# Altium schematic sheet TPS60400.SchDoc
size A4
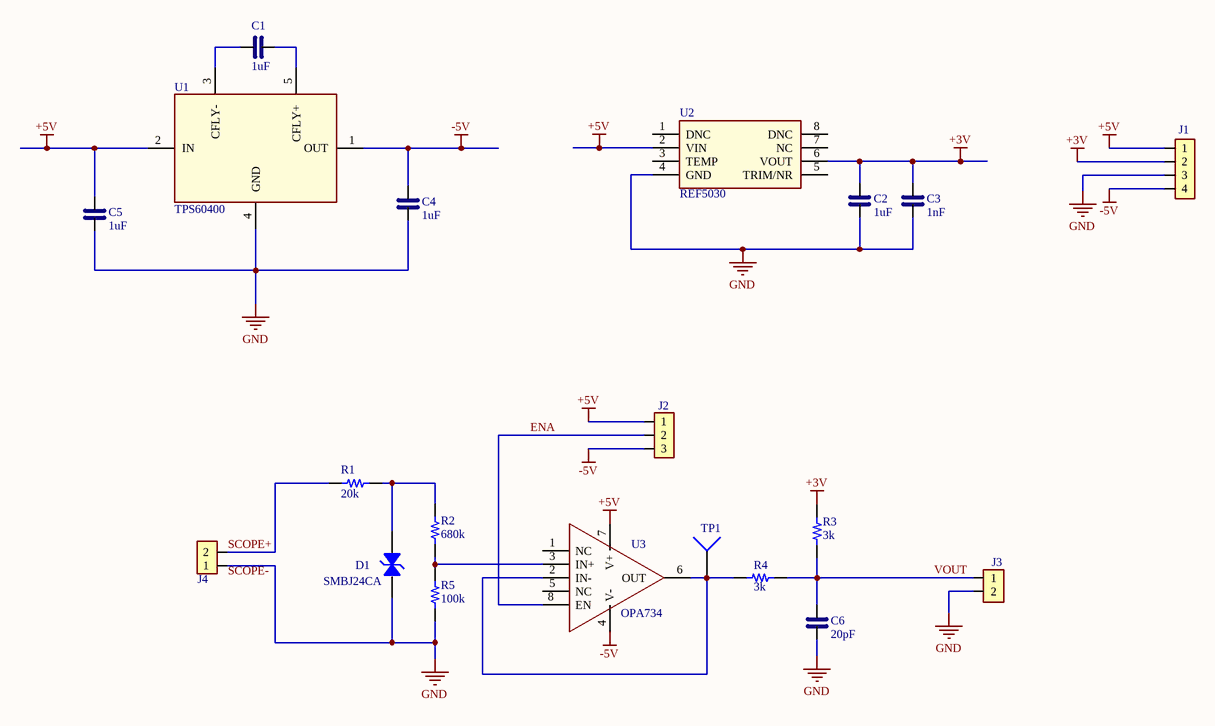
[diagram p0: TPS60400.SchDoc]

## Parts
C1  1uF  [CAP 0805/2012]
C2  1uF  [CAP 0805/2012]
C3  1nF  [CAP 0805/2012]
C4  1uF  [CAP 0805/2012]
C5  1uF  [CAP 0805/2012]
C6  20pF  [CAP 0805/2012]
D1  SMBJ24CA  [ST DO214AA SMB]
J1  Pin Header Male ( 4 pin )  [PIN HEADER MALE ( 4 PIN )]  (value not drawn)
J2  Pin Header Male ( 3 pin )  [PIN HEADER male ( 3 pin )]  (value not drawn)
J3  Pin Header Male ( 2 pin )  [PIN HEADER MALE ( 2 pin )]  (value not drawn)
J4  Pin Header Male ( 2 pin )  [PIN HEADER MALE ( 2 pin )]  (value not drawn)
R1  20k  [RES 0805/2012]
R2  680k  [RES 0805/2012]
R3  3k  [RES 0805/2012]
R4  3k  [RES 0805/2012]
R5  100k  [RES 0805/2012]
TP1  Socket  [PIN1]  (value not drawn)
U1  TPS60400  [SOT-23-5]
U2  REF5030  [SOIC-8 (150mil-3.9mm width)]
U3  OPA734  [SOIC-8 (150mil-3.9mm width)]

## Nets
+3V: C2.2 C3.2 J1.2 R3.1 U2.6(VOUT)
+5V: C5.2 J1.1 J2.1 U1.2(IN) U2.2(VIN) U3.7(V+)
-5V: C4.2 J1.4 J2.3 U1.1(OUT) U3.4(V-)
GND: C2.1 C3.1 C4.1 C5.1 C6.1 D1.1 J1.3 J3.2 J4.1 R5.1 U1.4(GND) U2.4(GND)
ENA: J2.2 U3.8(EN)
VOUT: C6.2 J3.1 R3.2 R4.1
NetC1_1: C1.1 U1.5(CFLY+)
NetC1_2: C1.2 U1.3(CFLY-)
NetD1_2: D1.2 R1.1 R2.2
NetJ4_2: J4.2 R1.2
NetR2_1: R2.1 R5.2 U3.3(IN+)
NetR4_2: R4.2 TP1.1 U3.2(IN-) U3.6(OUT)

Not connected (* = marked no-connect by the designer): U2 1(DNC) 3(TEMP) 5(TRIM/NR) 7(NC) 8(DNC); U3 1(NC) 5(NC)

## Notes on the sheet
- (near J4) SCOPE+
- (near J4) SCOPE-

## Library data of the parts
C1-C6 = CAP 0805/2012
D1 = ESD05V88D-LC: DIODE SCHOTTKY 40V 2A DO214AA
R1-R5 = RES 0805/2012 ( 1/8W )
U1 = TPS60400: IC REG SWTCHD CAP INV 60MA SOT23
U2 = REF5030: Series Voltage Reference IC ±0.1% 10mA
U3 = OPA734: IC OPAMP CHOPPER 1.6MHZ 8SOIC
TP1 = Socket: LatestRevisionDate: 17-Jul-2002; LatestRevisionNote: Re-released for DXP Platform.; Publisher: Altium Limited